# EAGLE design smoothieboard_daugterboard_Plasma (EAGLE 7.5.0)

## Sheet 1 of 2
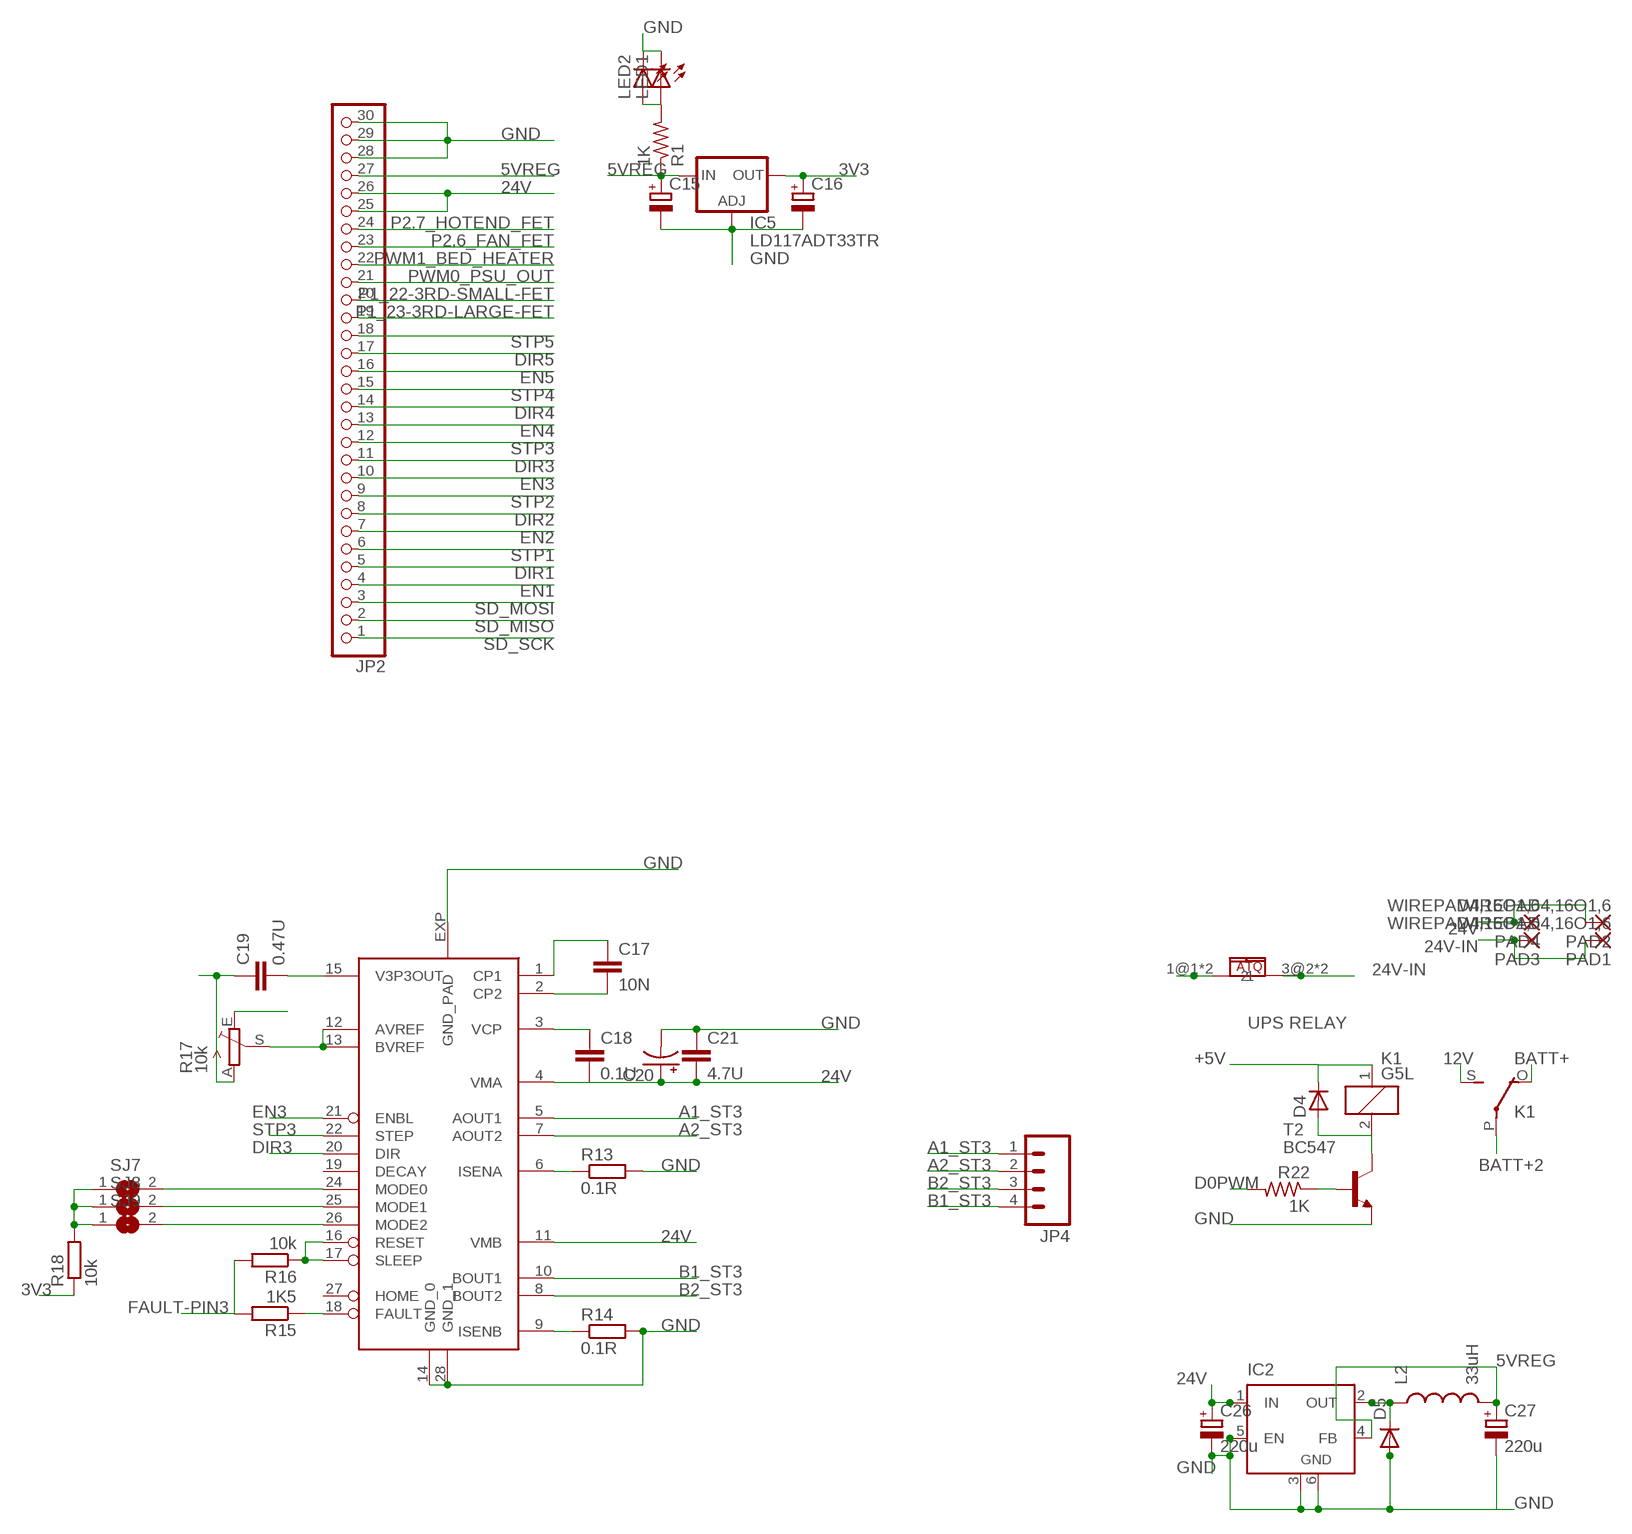
[diagram p0: schematic, sheet 1]

### Parts
C15  CPOL-EUB/3528-21R  [B/3528-21R]
C16  CPOL-EUB/3528-21R  [B/3528-21R]
C17  10N  CAP1206  [1206]
C18  0.1U  CAP1206  [1206]
C19  0.47U  CAP0805  [0805]
C20  CPOL-USE2.5-7  [E2,5-7]
C21  4.7U  CAP1206  [1206]
C26  220u  CPOL-EUE  [PANASONIC_E]
C27  220u  CPOL-EUE  [PANASONIC_E]
D4  D-MLL-41  [MELF-MLL41]
D5  DIODE-DO-214AC  [DO-214AC]
IC2  LM2596S  [TO263-5]
IC5  LD117ADT33TR  [DPACK]
JP2  PINHD-1X30  [1X30]
JP4  M04SCREW  [SCREWTERMINAL-3.5MM-4]
K1  G5L  [G5LE]
L2  33uH  INDUCTORPWR  [CDRH125]
LED1  LEDCHIPLED_1206  [CHIPLED_1206]
LED2  LED3MM  [LED3MM]
PAD1  WIREPAD4,16O1,6  [4,16O1,6]
PAD2  WIREPAD4,16O1,6  [4,16O1,6]
PAD3  WIREPAD4,16O1,6  [4,16O1,6]
PAD4  WIREPAD4,16O1,6  [4,16O1,6]
R1  1K  R-US_M1206  [M1206]
R13  0.1R  R-EU_R1206  [R1206]
R14  0.1R  R-EU_R1206  [R1206]
R15  1K5  R-EU_R0805  [R0805]
R16  10k  R-EU_R0805  [R0805]
R17  10k  TRIM_EU-S64W  [S64W]
R18  10k  R-EU_R1206  [R1206]
R22  1K  R-US_M1206  [M1206]
SJ7  SJ  [SJ]
SJ8  SJ  [SJ]
SJ9  SJ  [SJ]
T2  BC547  [TO92]
U$3  DRV8825PWP  [TSSOP-28]
U$7  CQ-121  [CQ121]

### Nets
3V3: C16.+ IC5.4(OUT) R17.E R18.1
5VREG: C15.+ C27.+ IC2.4(FB) IC5.3(IN) JP2.27 L2.2 R1.1
12V [power]: K1.S(2:S)
24V: C18.2 C20.+ C21.2 C26.+ IC2.1(IN) JP2.25 JP2.26 PAD2.1(P) PAD4.1(P) U$3.4(VMA) U$3.11(VMB)
24V-DC: U$7.1@1 U$7.2@1
24V-IN: PAD1.1(P) PAD3.1(P) U$7.3@2 U$7.4@2
+5V [power]: D4.1(C) K1.1
A1_ST3: JP4.1 U$3.5(AOUT1)
A2_ST3: JP4.2 U$3.7(AOUT2)
B1_ST3: JP4.4 U$3.10(BOUT1)
B2_ST3: JP4.3 U$3.8(BOUT2)
BATT+: K1.O(2:O)
BATT+2: K1.P(2:P)
CP5: C17.2 U$3.2(CP2)
CP6: C17.1 U$3.1(CP1)
D0PWM: R22.2
DIR1: JP2.5
DIR2: JP2.8
DIR3: JP2.11 U$3.20(DIR)
DIR4: JP2.14
DIR5: JP2.17
EN1: JP2.4
EN2: JP2.7
EN3: JP2.10 U$3.21(ENBL)
EN4: JP2.13
EN5: JP2.16
FAULT3: R15.1 U$3.18(FAULT)
FAULT-PIN3: R15.2 R16.2
GND: C15.- C16.- C19.1 C20.- C21.1 C26.- C27.- D5.2(A) IC2.3(GND) IC2.5(EN) IC2.6(GND) IC5.1(ADJ) JP2.28 JP2.29 JP2.30 LED1.C LED2.K(C) R13.2 R14.2 R17.A T2.1(E) U$3.14(GND_0) U$3.28(GND_1) U$3.EXP(GND_PAD)
MSPULLUP2: R18.2 SJ7.1 SJ7.2 SJ8.1 SJ8.2 SJ9.1 SJ9.2 U$3.24(MODE0) U$3.25(MODE1) U$3.26(MODE2)
N$7: LED1.A LED2.A R1.2
N$8: R17.S U$3.12(AVREF) U$3.13(BVREF)
N$9: D4.2(A) K1.2 T2.3(C)
N$10: R22.1 T2.2(B)
N$11: D5.1(C) IC2.2(OUT) L2.1
P1_22-3RD-SMALL-FET: JP2.20
P1_23-3RD-LARGE-FET: JP2.19
P2.6_FAN_FET: JP2.23
P2.7_HOTEND_FET: JP2.24
PWM0_PSU_OUT: JP2.21
PWM1_BED_HEATER: JP2.22
SD_MISO: JP2.2
SD_MOSI: JP2.3
SD_SCK: JP2.1
SENA2: R13.1 U$3.6(ISENA)
SENB2: R14.1 U$3.9(ISENB)
SLEEP2: R16.1 U$3.16(RESET) U$3.17(SLEEP)
STP1: JP2.6
STP2: JP2.9
STP3: JP2.12 U$3.22(STEP)
STP4: JP2.15
STP5: JP2.18
V3VP3: C19.2 U$3.15(V3P3OUT)
VCP2: C18.1 U$3.3(VCP)
Unconnected: U$3.19(DECAY) U$3.27(HOME)

### Notes on the sheet
- UPS RELAY

## Sheet 2 of 2

## Library data of the parts
C15 C16 C26 C27 = rcl:CPOL-EU: POLARIZED CAPACITOR, European symbol
C17-C19 C21 = SparkFun-Capacitors:CAP: Capacitor Standard 0603 ceramic capacitor, and 0.1" leaded capacitor.
C20 = adafruit:CPOL-US: POLARIZED CAPACITOR, American symbol
D4 = semicon-smd-ipc:D-: DIODE unfilled
D5 = dp_devices:DIODE: Various Diode Packages
IC2 = linear:LM2596S: STEP-DOWN VOLTAGE REGULATOR
IC5 = v-reg:LD117A?*: Low drop fixed and adjustable positive voltage regulators 1 A Source: http://www.st.com/stonline/products/literature/ds/7194/ld1117axx.pdf
JP2 = pinhead:PINHD-1X30: PIN HEADER
JP4 = SparkFun-Connectors:M04: Header 4 Standard 4-pin 0.1" header. Use with straight break away headers (SKU : PRT-00116), right angle break away headers (PRT-00553), swiss pins (PRT-00743), machine pins (PRT-00117), and female headers (PRT-00115). Molex polarized connector foot print use with SKU : PRT-08231 with associated crimp pins and housings. 1MM SMD Version SKU: PRT-10208; PROD_ID: Combine 2x8399
K1 = relay:G5L: RELAY 1 x switch, 10 A/120 V AC, 8 A/30 V ADC, Omron; OC_FARNELL: unknown; OC_NEWARK: unknown
L2 = SparkFun-Passives:INDUCTOR: Inductors Basic Inductor/Choke - 0603 and 1206. Footprints are not proven and vary greatly between part numbers. SRN6045- 33uH, 20% 1.4A SDR0403-560KL - 56uH, 10%, 500mA RMS/740mA peak
LED1 LED2 = adafruit:LED: LED OSRAM: - CHIPLED LG R971, LG N971, LY N971, LG Q971, LY Q971, LO R971, LY R971 LH N974, LH R974 LS Q976, LO Q976, LY Q976 LO Q996 - Hyper CHIPLED LW Q18S LB Q993, LB Q99A, LB R99A - SideLED LS A670, LO A670, LY A670, LG A670, LP A670 LB A673, LV A673, LT A673, LW A673 LH A674 LY A675 LS A676, LA A676, LO A676, LY A676, LW A676 LS A679, LY A679, LG A679 - Hyper Micro SIDELED® LS Y876, LA Y876, LO Y876, LY Y876 LT Y87S - SmartLED LW L88C, LW L88S LB L89C, LB L89S, LG L890 LS L89K, LO L89K, LY L89K LS L896, LA L896, LO L896, LY L896 - TOPLED LS T670, LO T670, LY T670, LG T670, LP T670 LSG T670, LSP T670, LSY T670, LOP T670, LYG T670 LG T671, LOG T671, LSG T671 LB T673, LV T673, LT T673, LW T673 LH T674 LS T676, LA T676, LO T676, LY T676, LB T676, LH T676, LSB T676, LW T676 LB T67C, LV T67C, LT T67C, LS T67K, LO T67K, LY T67K, LW E67C LS E67B, LA E67B, LO E67B, LY E67B, LB E67C, LV E67C, LT E67C LW T67C LS T679, LY T679, LG T679 LS T770, LO T770, LY T770, LG T770, LP T770 LB T773, LV T773, LT T773, LW T773 LH T774 LS E675, LA E675, LY E675, LS T675 LS T776, LA T776, LO T776, LY T776, LB T776 LHGB T686 LT T68C, LB T68C - Hyper Mini TOPLED® LB M676 - Mini TOPLED Santana® LG M470 LS M47K, LO M47K, LY M47K Source: http://www.osram.convergy.de/
PAD1-PAD4 = wirepad:WIREPAD: Wire PAD connect wire on PCB
R1 R22 = adafruit:R-US_: RESISTOR, American symbol
R13-R16 R18 = rcl:R-EU_: RESISTOR, European symbol
R17 = pot:TRIM_EU-: POTENTIOMETER
SJ7-SJ9 = jumper:SJ: SMD solder JUMPER
T2 = transistor:BC547: NPN TRANSISTOR
U$3 = drv88xx:DRV8825PWP
U$7 = Mantech.co.za:CQ-121

## Net classes
1 power: width 0.6 mm, clearance 0.305 mm

## Board
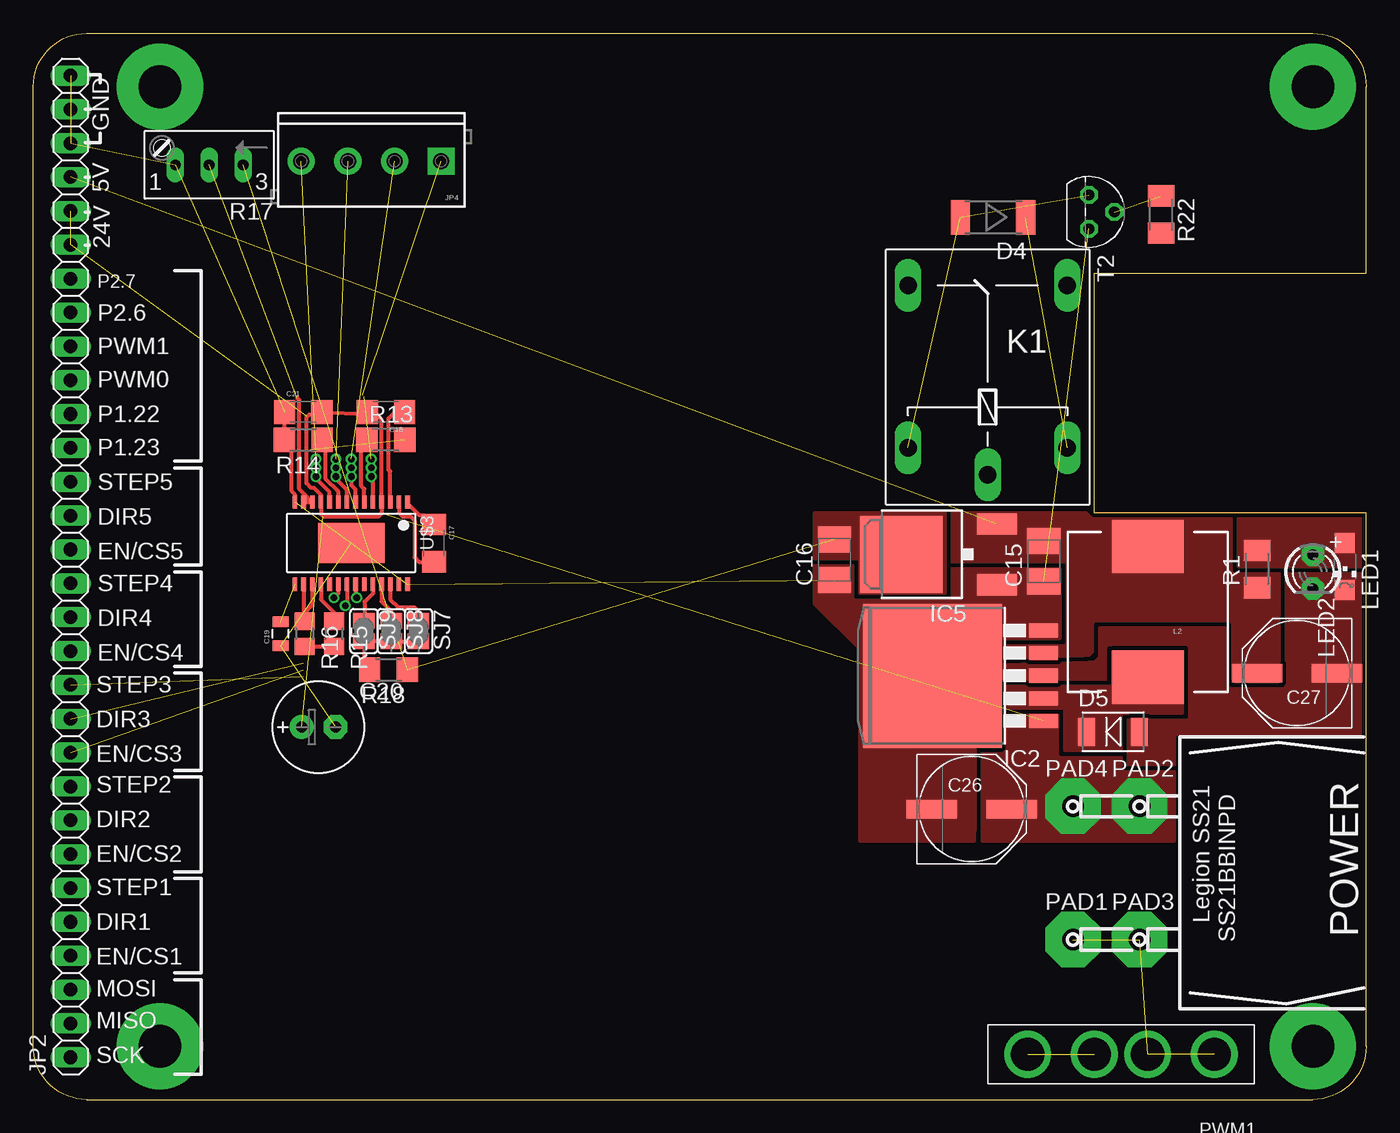
[diagram p1: board, top side]
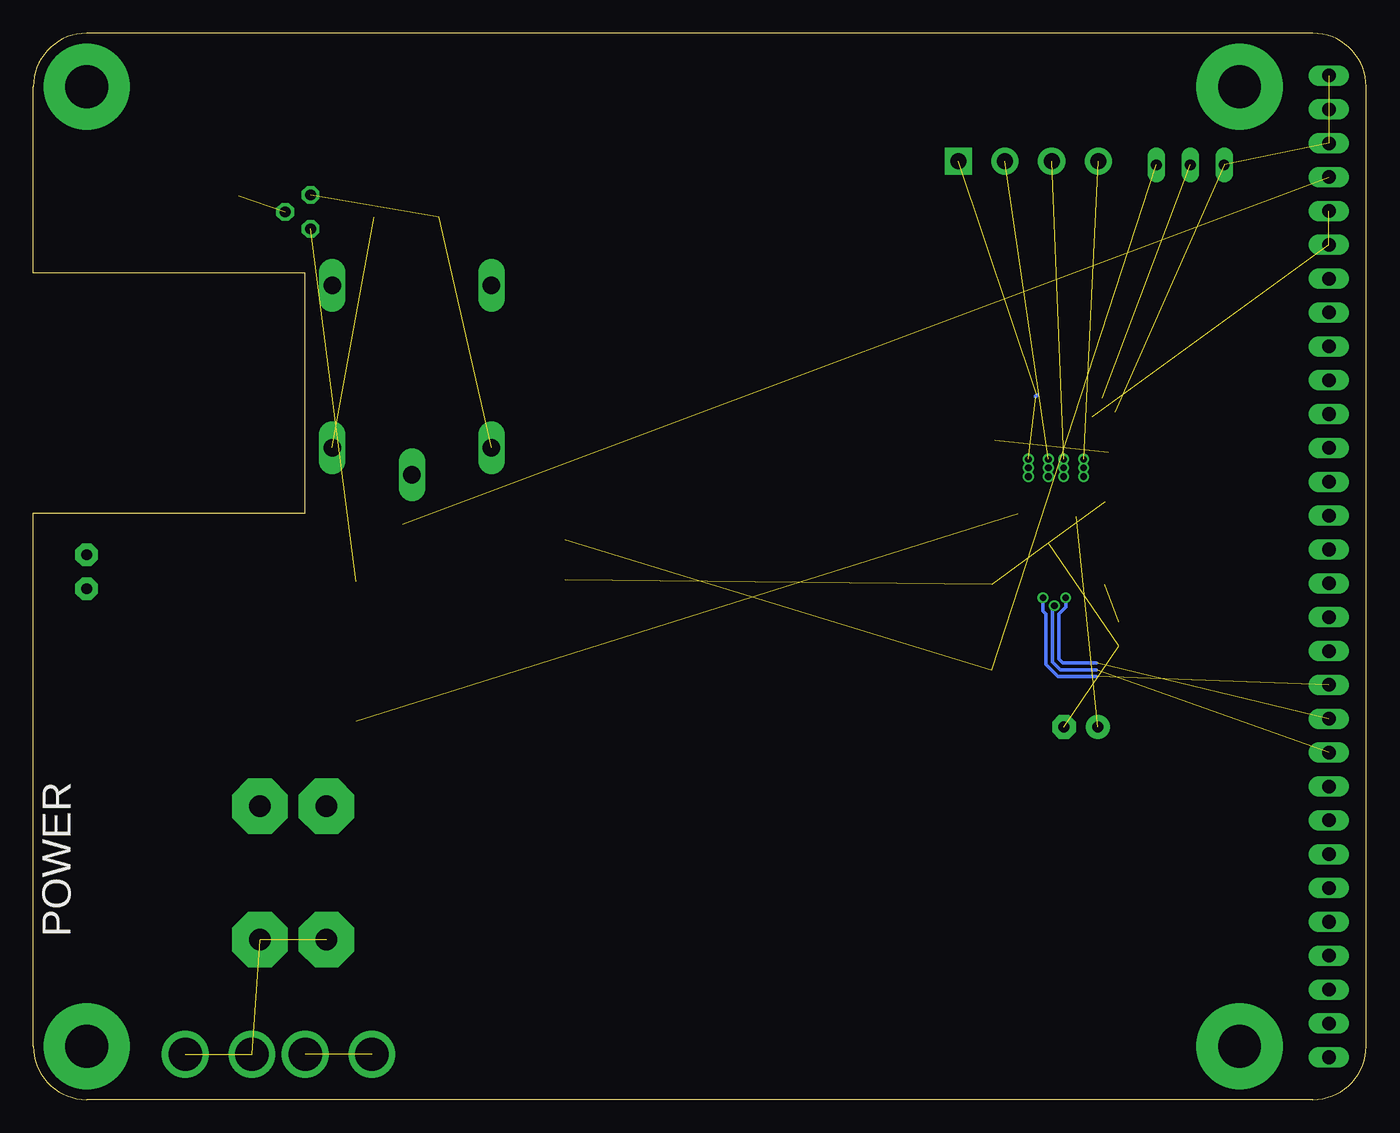
[diagram p2: board, bottom side, seen from below]

Size 100 x 80 mm. Coordinates in mm from the lower left corner, seen from the top.
Outline: 4,0 96,0 arc90 100,4 100,44 79.6,44 79.6,62 100,62 100,76 arc90 96,80 4,80 arc90 0,76 0,4 arc90 4,0
Copper layers (1*16): Top 0.035mm / dielectric 1.5mm / Bottom 0.035mm
Design rules "dirt_cheap_dirty_boards.v1": minimum track width 5mil, minimum drill 12mil, track to track 5mil, track to pad 5mil, pad to pad 5mil, via to via 5mil, smd to smd 0mil, copper to edge 10mil, drill to drill 10mil, minimum pad ring 10mil, minimum via ring 6mil, stop-mask expansion 2mil, vias tented up to drill 25mil, thermal gap 10mil

### Footprints (pad centres in the part's own frame; a part is rotated, then mirrored left to right if it is on the bottom)
B/3528-21R = smd 1.95 x 2.5: + 1.525,0; - -1.525,0
1206 = smd 1.6 x 1.8: 1 -1.4,0; 2 1.4,0
0805 = smd 0.8 x 1.2: 1 -0.9,0; 2 0.9,0
E2,5-7 = drill 0.813 pad 1.778: + -1.27,0 | drill 0.813 pad 1.778 octagon: - 1.27,0
PANASONIC_E = smd 3.8 x 1.4: + 3,0; - -3,0
MELF-MLL41 = smd 1.45 x 2.6: 1 -2.445,0; 2 2.445,0
DO-214AC = smd 1.27 x 2.1: 1 -1.98,0; 2 1.98,0
TO263-5 = smd 1.067 x 2.159: 1 -3.404,-5.791; 2 -1.702,-5.791; 3 0,-5.791; 4 1.702,-5.791; 5 3.404,-5.791 | smd 10.8 x 10.41: 6 0,2.54
DPACK = smd 1.6 x 3: 1 -2.28,-4.8; 3 2.28,-4.8 | smd 5.8 x 6.2: 4 0,2.38
1X30 = drill 1.016 long: 1 -36.83,0; 2 -34.29,0; 3 -31.75,0; 4 -29.21,0; 5 -26.67,0; 6 -24.13,0; 7 -21.59,0; 8 -19.05,0; 9 -16.51,0; 10 -13.97,0; 11 -11.43,0; 12 -8.89,0; 13 -6.35,0; 14 -3.81,0; 15 -1.27,0; 16 1.27,0; 17 3.81,0; 18 6.35,0; 19 8.89,0; 20 11.43,0; 21 13.97,0; 22 16.51,0; 23 19.05,0; 24 21.59,0; 25 24.13,0; 26 26.67,0; 27 29.21,0; 28 31.75,0; 29 34.29,0; 30 36.83,0
SCREWTERMINAL-3.5MM-4 = drill 1.2 pad 2.032 square: 1 0,0 | drill 1.2 pad 2.032: 2 3.5,0; 3 7,0; 4 10.5,0
G5LE = drill 1.321 long: 1 -7.493,-5.969; 2 -7.493,5.969; O 4.699,5.969; P -9.525,0; S 4.699,-5.969
CDRH125 = smd 5.4 x 4: 1 0,4.9; 2 0,-4.9
CHIPLED_1206 = smd 1.5 x 1.5: A 0,-1.75; C 0,1.75
LED3MM = drill 0.813 pad 1.676 octagon: A -1.27,0; K 1.27,0
4,16O1,6 = drill 1.6 pad 4.166 octagon: 1 0,0
M1206 = smd 1.6 x 2: 1 -1.4,0; 2 1.4,0
R1206 = smd 1.6 x 1.803: 1 -1.422,0; 2 1.422,0
R0805 = smd 1.3 x 1.5: 1 -0.95,0; 2 0.95,0
S64W = drill 0.813 long: A 2.54,1.27; E -2.54,1.27; S 0,1.27
SJ = smd 1.168 x 1.6: 1 -0.762,0; 2 0.762,0
TO92 = drill 0.813 octagon: 1 1.27,0; 2 0,1.905; 3 -1.27,0
TSSOP-28 = smd 0.35 x 1: 1 -4.225,-3.087; 2 -3.575,-3.087; 3 -2.925,-3.087; 4 -2.275,-3.087; 5 -1.625,-3.087; 6 -0.975,-3.087; 7 -0.325,-3.087; 8 0.325,-3.087; 9 0.975,-3.087; 10 1.625,-3.087; 11 2.275,-3.087; 12 2.925,-3.087; 13 3.575,-3.087; 14 4.225,-3.087; 15 4.225,3.087; 16 3.575,3.087; 17 2.925,3.087; 18 2.275,3.087; 19 1.625,3.087; 20 0.975,3.087; 21 0.325,3.087; 22 -0.325,3.087; 23 -0.975,3.087; 24 -1.625,3.087; 25 -2.275,3.087; 26 -2.925,3.087; 27 -3.575,3.087; 28 -4.225,3.087 | smd 5 x 3: EXP 0,0
CQ121 = drill 2.5: 1@1 -7,0; 2@1 -2,0; 3@2 2,0; 4@2 7,0

### Placement (x,y rotation side)
C15  75.8,40.4 90 top
C16  60.1,40.5 90 top
C17  30.05,41.75 270 top
C18  26.45,51.6 180 top
C19  18.55,34.95 90 top
C20  21.4,27.95 0 top
C21  20.25,51.6 0 top
C26  70.4,21.8 0 top
C27  94.8,32 180 top
D4  72,66.2 180 top
D5  81,27.6 0 top
IC2  70,31.8 90 top
IC5  67.5,40.9 90 top
JP2  2.8,40 90 top
JP4  30.6,70.4 180 top
K1  71.6,56.4 90 top
L2  83.6,36.6 180 top
LED1  98.4,40 180 top
LED2  96,39.6 270 top
PAD1  78,12 0 top
PAD2  83,22 0 top
PAD3  83,12 0 top
PAD4  78,22 0 top
R1  91.8,39.8 90 top
R13  26.45,49.5 0 top
R14  20.25,49.5 180 top
R15  22.55,34.95 270 top
R16  20.35,34.95 270 top
R17  13.2,71.4 180 top
R18  26.65,32.25 180 top
R22  84.6,66.4 270 top
SJ7  28.9,35.15 270 top
SJ8  26.85,35.15 270 top
SJ9  24.8,35.15 270 top
T2  79.2,66.6 270 top
U$3  23.85,41.75 180 top
U$7  81.6,3.4 0 top

### Tracks (layer width: path | path; a pad name or v marks a point on that pad's centre or on a via)
3V3  (2 unrouted)
  pour Top (isolate 0.305, no thermals): 58.8,40.6 62,40.6 62,38 68.4,38 68.4,44 58.6,44 58.6,40.6
5VREG  (1 unrouted)
  pour Top (isolate 0.305, rank 4, no thermals): 73,33 79.4,33 79.6,33.2 79.6,35.8 90,35.8 90,31.4 90.2,31.2 93.4,31.2 93.6,31.4 93.6,39.6 90,39.6 90,43.6 79.4,43.6 79,44 68.8,44 68.8,40.2 77.4,40.2 77.4,35 73,35
24V  (4 unrouted)
  Top 0.305: U$3.11 21.57,43.92 21.75,43.75 25.9,43.75 26.12,43.98 U$3.4 26.12,51.02 25.75,51.4 C18.2 25,51.45 C21.2 21.6,51.4 20.7,51.4 20.55,51.25 | 20.5,51.2 20.5,46.25 20.85,45.9 21.05,45.9 21.57,45.38 U$3.11 | 21.55,44.86 U$3.11
  pour Top (isolate 0.305, rank 2, no thermals): 73,29 77,29 77,25.8 81.6,25.8 81.6,24.6 85.6,24.6 85.6,19.4 71.2,19.4 71.2,26 72.8,26 73,26.2
24V-DC  (1 unrouted)
24V-IN  (3 unrouted)
+5V  (1 unrouted)
A1_ST3  (via drill 0.5 pad 0.25)  (2 unrouted)
  Top 0.305: U$3.5 25.48,46.62 v25.35,46.75 v25.35,47.4 v25.35,48.05
  Bottom 0.305: 24.8,52.75 24.7,52.85
A2_ST3  (via drill 0.5 pad 0.25)  (1 unrouted)
  Top 0.305: v23.85,48.05 v23.85,47.4 v23.85,46.75 23.85,46.1 24.15,45.8 24.15,44.86 U$3.7
B1_ST3  (via drill 0.5 pad 0.25)  (1 unrouted)
  Top 0.305: U$3.10 22.23,45.58 21.2,46.6 v21.2,46.75 v21.2,47.4 v21.2,48.05
B2_ST3  (via drill 0.5 pad 0.25)  (1 unrouted)
  Top 0.305: U$3.8 23.52,45.73 22.7,46.55 v22.7,46.75 v22.7,47.4 v22.7,48.05
CP5
  Top 0.305: U$3.2 27.43,44.02 27.7,43.75 28.3,43.75 28.6,43.45 28.6,40.7 28.95,40.35 C17.2
CP6
  Top 0.305: U$3.1 28.07,44.73 28.95,43.85 29.35,43.85 C17.1
DIR3  (via drill 0.5 pad 0.25)  (1 unrouted)
  Top 0.305: U$3.20 22.88,37.98 v22.55,37.65
  Bottom 0.254: v22.55,37.65 22.55,36.95 23.05,36.45 23.05,33.05 22.75,32.75 20.25,32.75
EN3  (via drill 0.5 pad 0.25)  (1 unrouted)
  Top 0.305: U$3.21 23.52,37.17 v23.4,37.05
  Bottom 0.254: v23.4,37.05 23.55,36.9 23.55,32.85 22.95,32.25 20.25,32.25
FAULT3
  Top 0.254: 22.55,36.55 R15.1
  Top 0.305: U$3.18 21.57,37.52 22.55,36.55
FAULT-PIN3
  Top 0.305: R16.2 R15.2
GND  (11 unrouted)
  Top 0.305: C21.1 18.88,51.42 R14.2 18.82,49.15 18.85,49.15 19.3,49.1 19.25,48.95 19.35,48.6 19.35,45.7 19.6,45.45 19.6,44.86 U$3.14
  pour Top (isolate 0.305, rank 3, no thermals): 70.6,19.4 70.8,26.4 72.6,26.4 72.6,31.2 72.8,31.4 80.8,31.4 80.8,34.2 86.6,34.2 86.6,28.6 82,28.6 82,25 85.6,25 85.6,27.4 99.8,27.4 99.8,39.6 94,39.6 94,31 93.8,30.8 89.8,30.8 89.4,31.2 89.4,35.4 80,35.4 80,33.2 79.6,32.8 79.2,32.8 72.8,32.6 72.6,32.8 72.6,34.6 77,34.6 77,39.8 68.8,39.8 68.8,37.6 61.6,37.6 61.6,40.2 58.6,40.2 58.6,37.2 62,33.8 62,19.4
MSPULLUP2
  Top 0.254: SJ7.2 SJ7.1 28.85,35.96 | 24.85,35.96 SJ9.1 | 26.89,34.35 SJ8.2 | SJ9.2 24.8,32.68 R18.2
  Top 0.305: SJ9.1 SJ9.2 SJ8.2 SJ8.1 26.85,36.65 26.12,37.38 U$3.25 | U$3.24 25.48,37.98 24.85,37.35 24.85,35.96 | U$3.26 26.77,37.52 27.35,36.95 28.55,36.95 28.85,36.65 28.85,35.96 28.85,34.35 26.89,34.35
N$1  (via drill 3.2 pad 6.45)
  other vias: 9.5,76
N$2  (via drill 3.2 pad 6.45)
  other vias: 96,76
N$3  (via drill 3.2 pad 6.45)
  other vias: 96,4
N$5  (via drill 3.2 pad 6.45)
  other vias: 9.5,4
N$7
  pour Top (isolate 0.305, no thermals): 90.4,43.6 90.4,40 99.8,40 99.8,43.6
N$8  (1 unrouted)
  Top 0.305: U$3.13 20.27,44.83 | U$3.12 20.93,44.83 20.27,44.83 | 20.6,44.9 20.65,44.9 20.7,44.95 20.55,45.2 19.95,45.8 19.95,52.5 19.8,52.65 | 20.6,44.9 20.7,45 | 20.6,44.9 20.55,44.85 20.3,44.85 20.25,44.9 20.25,45.05 20.27,44.83
N$9  (2 unrouted)
N$10  (1 unrouted)
N$11
  pour Top (isolate 0.305, no thermals): 73,31 81,31 81,33.6 86.2,33.6 86.2,29 81.6,29 81.6,26.2 77.4,26.2 77.4,29.4 73,29.4
SENA2
  Top 0.305: R13.1 24.82,49.05 24.6,48.82 24.6,46.05 24.82,45.83 U$3.6
SENB2
  Top 0.305: 21.67,48.83 21.9,48.55 21.9,46.6 22.85,45.65 22.85,45.25 22.9,44.61 U$3.9
  Top 0.406: R14.1 21.67,48.83
SLEEP2
  Top 0.254: 20.27,36.45 20.27,35.98 R16.1
  Top 0.305: U$3.16 20.27,36.45 20.93,37.1 U$3.17
STP3  (via drill 0.5 pad 0.25)  (1 unrouted)
  Top 0.305: U$3.22 24.18,37.73 v24.25,37.65
  Bottom 0.254: v24.25,37.65 24.25,36.65 24.05,36.45 24.05,32.65 23.15,31.75 20.25,31.75
V3VP3  (1 unrouted)
VCP2
  Top 0.305: U$3.3 26.77,47.12 26.65,47.25 26.65,51.1 27,51.45 27.8,51.45 C18.1

### Text on the board
tPlace: GND | 5V | 24V | P2.7 | P2.6 | PWM1 | PWM0 | P1.22 | P1.23 | STEP5 | DIR5 | EN/CS5 | STEP4 | DIR4 | EN/CS4 | STEP3 | DIR3 | EN/CS3 | Legion SS21 | STEP2 | DIR2 | EN/CS2 | STEP1 | DIR1 | SS21BBINPD | POWER | EN/CS1 | MOSI | MISO | SCK
bPlace: POWER
tNames: PWM1 | PWM1